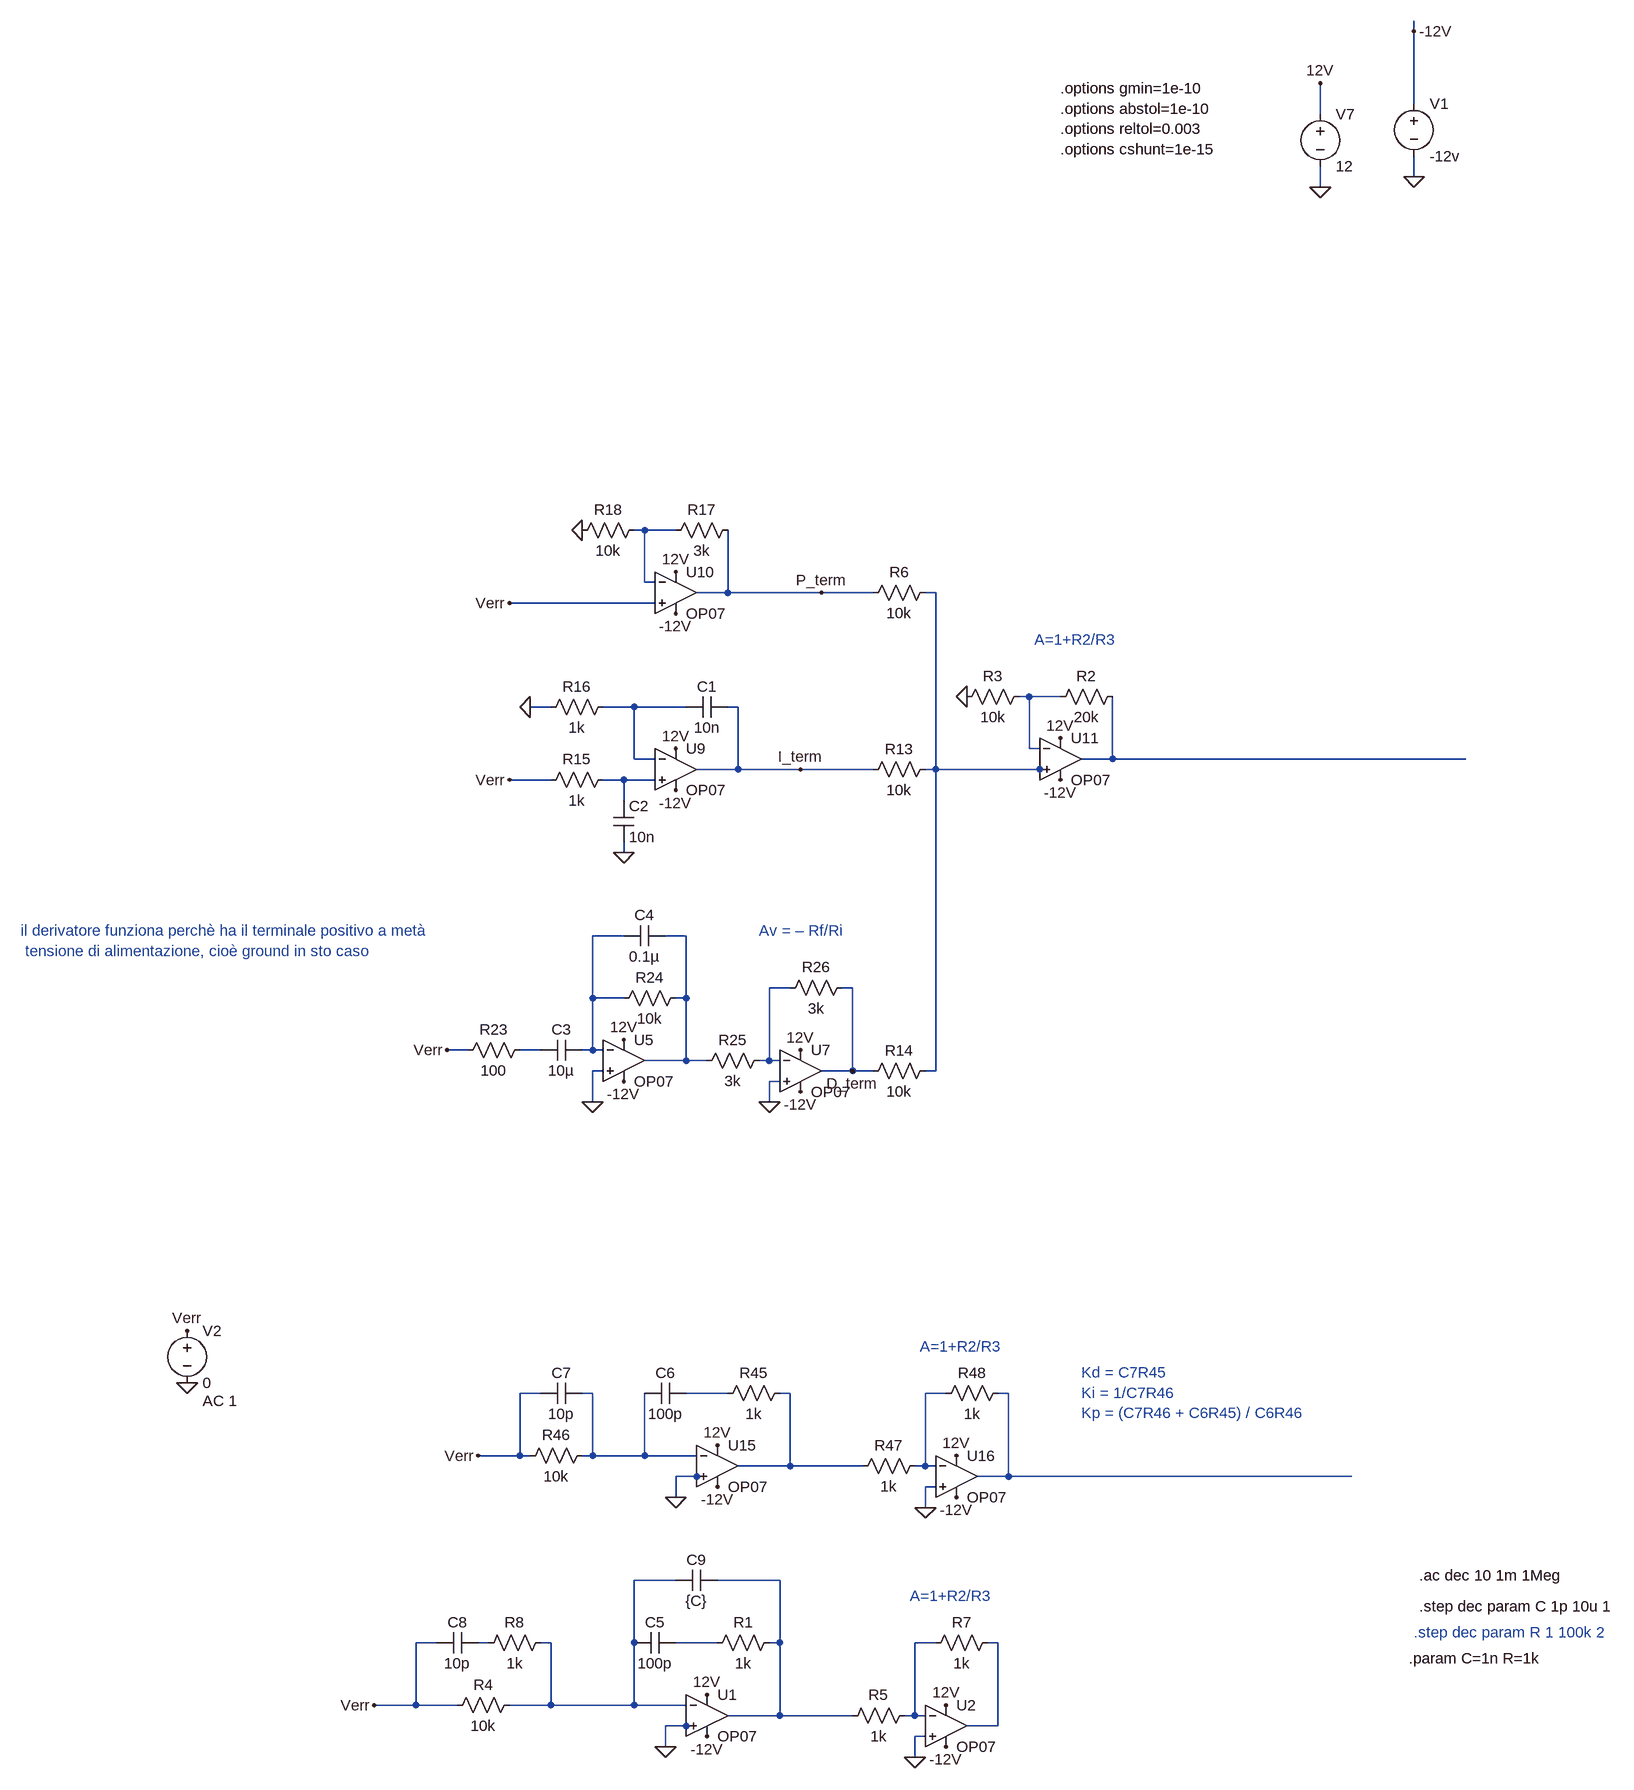
[diagram p0: schematic PID.asc]
PID.asc, the LTspice schematic file:
Version 4
SHEET 1 4364 2772
WIRE 1168 -1040 1168 -1056
WIRE 1168 -928 1168 -1040
WIRE 1024 -912 1024 -960
WIRE 1168 -816 1168 -848
WIRE 1024 -800 1024 -832
WIRE -16 -272 -32 -272
WIRE 32 -272 -16 -272
WIRE -16 -192 -16 -272
WIRE 0 -192 -16 -192
WIRE 112 -176 112 -272
WIRE 112 -176 64 -176
WIRE 256 -176 112 -176
WIRE 336 -176 256 -176
WIRE 432 -176 416 -176
WIRE 0 -160 -224 -160
WIRE 576 -16 560 -16
WIRE 624 -16 576 -16
WIRE -160 0 -192 0
WIRE -32 0 -80 0
WIRE 48 0 -32 0
WIRE 128 0 112 0
WIRE 576 64 576 -16
WIRE 592 64 576 64
WIRE -32 80 -32 0
WIRE 0 80 -32 80
WIRE 704 80 704 -16
WIRE 704 80 656 80
WIRE 1248 80 704 80
WIRE 128 96 128 0
WIRE 128 96 64 96
WIRE 224 96 128 96
WIRE 336 96 224 96
WIRE 432 96 432 -176
WIRE 432 96 416 96
WIRE 592 96 432 96
WIRE 608 96 592 96
WIRE -160 112 -224 112
WIRE -48 112 -80 112
WIRE 0 112 -48 112
WIRE -48 144 -48 112
WIRE -48 224 -48 208
WIRE -48 352 -96 352
WIRE 48 352 16 352
WIRE 208 432 176 432
WIRE 304 432 288 432
WIRE -96 448 -96 352
WIRE -48 448 -96 448
WIRE 48 448 48 352
WIRE 48 448 32 448
WIRE -288 528 -320 528
WIRE -176 528 -208 528
WIRE -96 528 -96 448
WIRE -96 528 -112 528
WIRE -80 528 -96 528
WIRE 48 544 48 448
WIRE 48 544 -16 544
WIRE 80 544 48 544
WIRE 176 544 176 432
WIRE 176 544 160 544
WIRE 192 544 176 544
WIRE -80 560 -96 560
WIRE 304 560 304 432
WIRE 304 560 256 560
WIRE 336 560 304 560
WIRE 432 560 432 96
WIRE 432 560 416 560
WIRE 192 576 176 576
WIRE -96 608 -96 560
WIRE 176 608 176 576
WIRE -176 1056 -208 1056
WIRE -96 1056 -112 1056
WIRE 112 1056 48 1056
WIRE 208 1056 192 1056
WIRE 448 1056 416 1056
WIRE 544 1056 528 1056
WIRE -208 1152 -208 1056
WIRE -208 1152 -272 1152
WIRE -192 1152 -208 1152
WIRE -96 1152 -96 1056
WIRE -96 1152 -112 1152
WIRE -16 1152 -16 1056
WIRE -16 1152 -96 1152
WIRE 64 1152 -16 1152
WIRE 208 1168 208 1056
WIRE 208 1168 128 1168
WIRE 320 1168 208 1168
WIRE 416 1168 416 1056
WIRE 416 1168 400 1168
WIRE 432 1168 416 1168
WIRE 64 1184 32 1184
WIRE 80 1184 64 1184
WIRE 544 1184 544 1056
WIRE 544 1184 496 1184
WIRE 1072 1184 544 1184
WIRE 432 1200 416 1200
WIRE 32 1216 32 1184
WIRE 416 1232 416 1200
WIRE 32 1344 -32 1344
WIRE 192 1344 96 1344
WIRE -336 1440 -368 1440
WIRE -256 1440 -272 1440
WIRE -160 1440 -176 1440
WIRE -32 1440 -32 1344
WIRE 96 1440 32 1440
WIRE 192 1440 192 1344
WIRE 192 1440 176 1440
WIRE 432 1440 400 1440
WIRE 528 1440 512 1440
WIRE -368 1536 -368 1440
WIRE -368 1536 -432 1536
WIRE -304 1536 -368 1536
WIRE -160 1536 -160 1440
WIRE -160 1536 -224 1536
WIRE -32 1536 -32 1440
WIRE -32 1536 -160 1536
WIRE 48 1536 -32 1536
WIRE 192 1552 192 1440
WIRE 192 1552 112 1552
WIRE 304 1552 192 1552
WIRE 400 1552 400 1440
WIRE 400 1552 384 1552
WIRE 416 1552 400 1552
WIRE 48 1568 16 1568
WIRE 64 1568 48 1568
WIRE 528 1568 528 1440
WIRE 528 1568 480 1568
WIRE 416 1584 400 1584
WIRE 16 1600 16 1568
WIRE 400 1616 400 1584
FLAG 1024 -800 0
FLAG 1024 -960 12V
FLAG 1168 -816 0
FLAG 1168 -1040 -12V
FLAG 32 128 -12V
FLAG 32 64 12V
FLAG 624 112 -12V
FLAG 624 48 12V
FLAG 480 -16 0
FLAG -192 0 0
FLAG -224 112 Verr
FLAG -48 224 0
FLAG 32 -144 -12V
FLAG 32 -208 12V
FLAG -112 -272 0
FLAG -224 -160 Verr
FLAG -48 576 -12V
FLAG -48 512 12V
FLAG -320 528 Verr
FLAG -96 608 0
FLAG 224 592 -12V
FLAG 224 528 12V
FLAG 176 608 0
FLAG 256 -176 P_term
FLAG 224 96 I_term
FLAG 304 560 D_term
FLAG 96 1200 -12V
FLAG 96 1136 12V
FLAG -272 1152 Verr
FLAG 32 1216 0
FLAG 464 1216 -12V
FLAG 464 1152 12V
FLAG 416 1232 0
FLAG 80 1584 -12V
FLAG 80 1520 12V
FLAG -432 1536 Verr
FLAG 16 1600 0
FLAG 448 1600 -12V
FLAG 448 1536 12V
FLAG 400 1616 0
FLAG -720 1040 0
FLAG -720 960 Verr
SYMBOL voltage 1024 -928 R0
WINDOW 123 0 0 Left 0
WINDOW 39 0 0 Left 0
SYMATTR InstName V7
SYMATTR Value 12
SYMBOL voltage 1168 -944 R0
WINDOW 123 0 0 Left 0
WINDOW 39 0 0 Left 0
SYMATTR InstName V1
SYMATTR Value -12v
SYMBOL res 720 -32 R90
WINDOW 0 0 56 VBottom 2
WINDOW 3 32 56 VTop 2
SYMATTR InstName R2
SYMATTR Value 20k
SYMBOL res 576 -32 R90
WINDOW 0 0 56 VBottom 2
WINDOW 3 32 56 VTop 2
SYMATTR InstName R3
SYMATTR Value 10k
SYMBOL res 432 -192 R90
WINDOW 0 0 56 VBottom 2
WINDOW 3 32 56 VTop 2
SYMATTR InstName R6
SYMATTR Value 10k
SYMBOL res 432 80 R90
WINDOW 0 0 56 VBottom 2
WINDOW 3 32 56 VTop 2
SYMATTR InstName R13
SYMATTR Value 10k
SYMBOL res 432 544 R90
WINDOW 0 0 56 VBottom 2
WINDOW 3 32 56 VTop 2
SYMATTR InstName R14
SYMATTR Value 10k
SYMBOL res -64 96 R90
WINDOW 0 0 56 VBottom 2
WINDOW 3 32 56 VTop 2
SYMATTR InstName R15
SYMATTR Value 1k
SYMBOL res -64 -16 R90
WINDOW 0 0 56 VBottom 2
WINDOW 3 32 56 VTop 2
SYMATTR InstName R16
SYMATTR Value 1k
SYMBOL cap 112 -16 R90
WINDOW 0 0 32 VBottom 2
WINDOW 3 32 32 VTop 2
SYMATTR InstName C1
SYMATTR Value 10n
SYMBOL cap -64 144 R0
SYMATTR InstName C2
SYMATTR Value 10n
SYMBOL res 128 -288 R90
WINDOW 0 0 56 VBottom 2
WINDOW 3 32 56 VTop 2
SYMATTR InstName R17
SYMATTR Value 3k
SYMBOL res -16 -288 R90
WINDOW 0 0 56 VBottom 2
WINDOW 3 32 56 VTop 2
SYMATTR InstName R18
SYMATTR Value 10k
SYMBOL cap -112 512 R90
WINDOW 0 0 32 VBottom 2
WINDOW 3 32 32 VTop 2
SYMATTR InstName C3
SYMATTR Value 10µ
SYMBOL res -192 512 R90
WINDOW 0 0 56 VBottom 2
WINDOW 3 32 56 VTop 2
SYMATTR InstName R23
SYMATTR Value 100
SYMBOL res 48 432 R90
WINDOW 0 0 56 VBottom 2
WINDOW 3 32 56 VTop 2
SYMATTR InstName R24
SYMATTR Value 10k
SYMBOL cap 16 336 R90
WINDOW 0 0 32 VBottom 2
WINDOW 3 32 32 VTop 2
SYMATTR InstName C4
SYMATTR Value 0.1µ
SYMBOL res 176 528 R90
WINDOW 0 0 56 VBottom 2
WINDOW 3 32 56 VTop 2
SYMATTR InstName R25
SYMATTR Value 3k
SYMBOL res 304 416 R90
WINDOW 0 0 56 VBottom 2
WINDOW 3 32 56 VTop 2
SYMATTR InstName R26
SYMATTR Value 3k
SYMBOL OpAmps\\OP07 -48 480 R0
SYMATTR InstName U5
SYMBOL OpAmps\\OP07 224 496 R0
SYMATTR InstName U7
SYMBOL OpAmps\\OP07 32 32 R0
SYMATTR InstName U9
SYMBOL OpAmps\\OP07 32 -240 R0
SYMATTR InstName U10
SYMBOL OpAmps\\OP07 624 16 R0
SYMATTR InstName U11
SYMBOL OpAmps\\OP07 96 1104 R0
SYMATTR InstName U15
SYMBOL res 208 1040 R90
WINDOW 0 0 56 VBottom 2
WINDOW 3 32 56 VTop 2
SYMATTR InstName R45
SYMATTR Value 1k
SYMBOL cap 48 1040 R90
WINDOW 0 0 32 VBottom 2
WINDOW 3 32 32 VTop 2
SYMATTR InstName C6
SYMATTR Value 100p
SYMBOL res -96 1136 R90
WINDOW 0 0 56 VBottom 2
WINDOW 3 32 56 VTop 2
SYMATTR InstName R46
SYMATTR Value 10k
SYMBOL res 416 1152 R90
WINDOW 0 0 56 VBottom 2
WINDOW 3 32 56 VTop 2
SYMATTR InstName R47
SYMATTR Value 1k
SYMBOL res 544 1040 R90
WINDOW 0 0 56 VBottom 2
WINDOW 3 32 56 VTop 2
SYMATTR InstName R48
SYMATTR Value 1k
SYMBOL OpAmps\\OP07 464 1120 R0
SYMATTR InstName U16
SYMBOL cap -112 1040 R90
WINDOW 0 0 32 VBottom 2
WINDOW 3 32 32 VTop 2
SYMATTR InstName C7
SYMATTR Value 10p
SYMBOL OpAmps\\OP07 80 1488 R0
SYMATTR InstName U1
SYMBOL res 192 1424 R90
WINDOW 0 0 56 VBottom 2
WINDOW 3 32 56 VTop 2
SYMATTR InstName R1
SYMATTR Value 1k
SYMBOL cap 32 1424 R90
WINDOW 0 0 32 VBottom 2
WINDOW 3 32 32 VTop 2
SYMATTR InstName C5
SYMATTR Value 100p
SYMBOL res -208 1520 R90
WINDOW 0 0 56 VBottom 2
WINDOW 3 32 56 VTop 2
SYMATTR InstName R4
SYMATTR Value 10k
SYMBOL res 400 1536 R90
WINDOW 0 0 56 VBottom 2
WINDOW 3 32 56 VTop 2
SYMATTR InstName R5
SYMATTR Value 1k
SYMBOL res 528 1424 R90
WINDOW 0 0 56 VBottom 2
WINDOW 3 32 56 VTop 2
SYMATTR InstName R7
SYMATTR Value 1k
SYMBOL OpAmps\\OP07 448 1504 R0
SYMATTR InstName U2
SYMBOL cap -272 1424 R90
WINDOW 0 0 32 VBottom 2
WINDOW 3 32 32 VTop 2
SYMATTR InstName C8
SYMATTR Value 10p
SYMBOL cap 96 1328 R90
WINDOW 0 0 32 VBottom 2
WINDOW 3 32 32 VTop 2
SYMATTR InstName C9
SYMATTR Value {C}
SYMBOL voltage -720 944 R0
WINDOW 123 24 124 Left 2
WINDOW 39 0 0 Left 0
SYMATTR Value2 AC 1
SYMATTR InstName V2
SYMATTR Value 0
SYMBOL res -160 1424 R90
WINDOW 0 0 56 VBottom 2
WINDOW 3 32 56 VTop 2
SYMATTR InstName R8
SYMATTR Value 1k
TEXT 624 -952 Left 2 !.options gmin=1e-10\n.options abstol=1e-10\n.options reltol=0.003\n.options cshunt=1e-15
TEXT 1168 1424 Left 2 ;.step dec param R 1 100k 2
TEXT 584 -104 Left 2 ;A=1+R2/R3
TEXT 1176 1384 Left 2 !.step dec param C 1p 10u 1
TEXT -976 344 Left 2 ;il derivatore funziona perchè ha il terminale positivo a metà\n tensione di alimentazione, cioè ground in sto caso
TEXT 160 344 Left 2 ;Av = – Rf/Ri
TEXT 408 984 Left 2 ;A=1+R2/R3
TEXT 656 1024 Left 2 ;Kd = C7R45\nKi = 1/C7R46\nKp = (C7R46 + C6R45) / C6R46
TEXT 1160 1464 Left 2 !.param C=1n R=1k
TEXT 392 1368 Left 2 ;A=1+R2/R3
TEXT 1176 1336 Left 2 !.ac dec 10 1m 1Meg

The netlist it stands for:
* PID.asc
V7 12V 0 12
V1 -12V 0 -12v
R2 N005 N003 20k
R3 N003 0 10k
R6 N002 P_term 10k
R13 N002 I_term 10k
R14 N002 D_term 10k
R15 N006 Verr 1k
R16 N004 0 1k
C1 I_term N004 10n
C2 N006 0 10n
R17 P_term N001 3k
R18 N001 0 10k
C3 N007 N010 10µ
R23 N010 Verr 100
R24 N008 N007 10k
C4 N008 N007 0.1µ
R25 N009 N008 3k
R26 D_term N009 3k
XU5 0 N007 12V -12V N008 LT1001  ; OP07, pins In+ In- V+ V- OUT
XU7 0 N009 12V -12V D_term LT1001  ; OP07, pins In+ In- V+ V- OUT
XU9 N006 N004 12V -12V I_term LT1001  ; OP07, pins In+ In- V+ V- OUT
XU10 Verr N001 12V -12V P_term LT1001  ; OP07, pins In+ In- V+ V- OUT
XU11 N002 N003 12V -12V N005 LT1001  ; OP07, pins In+ In- V+ V- OUT
XU15 0 N011 12V -12V N013 LT1001  ; OP07, pins In+ In- V+ V- OUT
R45 N013 N012 1k
C6 N012 N011 100p
R46 N011 Verr 10k
R47 N014 N013 1k
R48 N015 N014 1k
XU16 0 N014 12V -12V N015 LT1001  ; OP07, pins In+ In- V+ V- OUT
C7 N011 Verr 10p
XU1 0 N016 12V -12V N017 LT1001  ; OP07, pins In+ In- V+ V- OUT
R1 N017 N019 1k
C5 N019 N016 100p
R4 N016 Verr 10k
R5 N020 N017 1k
R7 N021 N020 1k
XU2 0 N020 12V -12V N021 LT1001  ; OP07, pins In+ In- V+ V- OUT
C8 N018 Verr 10p
C9 N017 N016 {C}
V2 Verr 0 0 AC 1
R8 N016 N018 1k
.options gmin=1e-10
.options abstol=1e-10
.options reltol=0.003
.options cshunt=1e-15
* .step dec param R 1 100k 2
* A=1+R2/R3
.step dec param C 1p 10u 1
* il derivatore funziona perchè ha il terminale positivo a metà
*  tensione di alimentazione, cioè ground in sto caso
* Av = – Rf/Ri
* A=1+R2/R3
* Kd = C7R45
* Ki = 1/C7R46
* Kp = (C7R46 + C6R45) / C6R46
.param C=1n R=1k
* A=1+R2/R3
.ac dec 10 1m 1Meg
.lib LTC.lib
.backanno
.end

* Results of the author's LTspice run, read from the files saved beside the schematic
* Operating Point (first step), zero values left out:
*   c = 1 p
*   V(12v) = 12 V
*   V(-12v) = -12 V
*   I(V1) = 20.25 mA
*   I(V7) = -20.25 mA
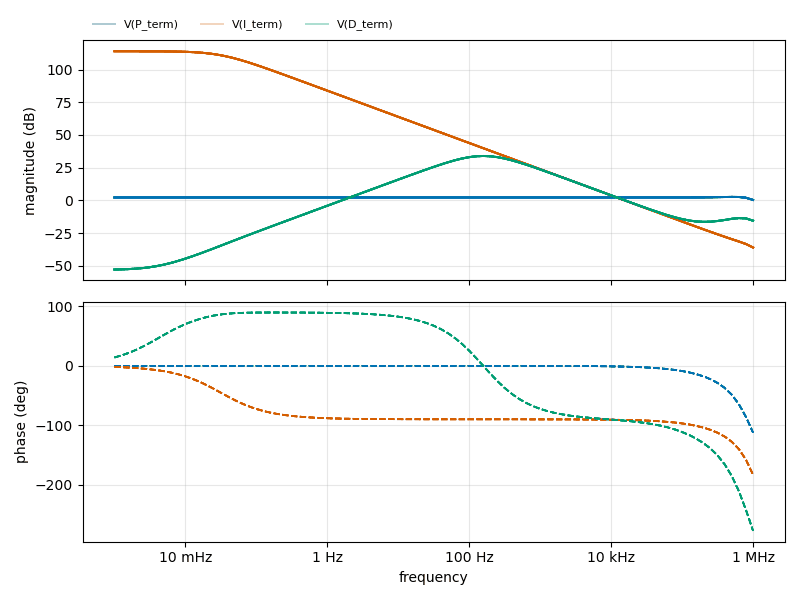
[diagram p1: AC Analysis of PID.asc, plotted from the saved traces]
* AC Analysis, 8 runs:
*   V(P_term) [c=1e-012]: 2.29 dB at 1 mHz, 0.38 dB at 1 MHz, peak 2.71 dB at 501.2 kHz
*   V(P_term) [c=1e-011]: 2.29 dB at 1 mHz, 0.38 dB at 1 MHz, peak 2.71 dB at 501.2 kHz
*   V(P_term) [c=1e-010]: 2.29 dB at 1 mHz, 0.38 dB at 1 MHz, peak 2.71 dB at 501.2 kHz
*   V(P_term) [c=1e-009]: 2.29 dB at 1 mHz, 0.38 dB at 1 MHz, peak 2.71 dB at 501.2 kHz
*   V(P_term) [c=1e-008]: 2.29 dB at 1 mHz, 0.38 dB at 1 MHz, peak 2.71 dB at 501.2 kHz
*   V(P_term) [c=1e-007]: 2.29 dB at 1 mHz, 0.38 dB at 1 MHz, peak 2.71 dB at 501.2 kHz
*   V(P_term) [c=1e-006]: 2.29 dB at 1 mHz, 0.38 dB at 1 MHz, peak 2.71 dB at 501.2 kHz
*   V(P_term) [c=1e-005]: 2.29 dB at 1 mHz, 0.38 dB at 1 MHz, peak 2.71 dB at 501.2 kHz
*   V(I_term) [c=1e-012]: 113.96 dB at 1 mHz, -35.95 dB at 1 MHz, peak 113.96 dB at 1 mHz, 3 dB below the peak at 31.31 mHz
*   V(I_term) [c=1e-011]: 113.96 dB at 1 mHz, -35.95 dB at 1 MHz, peak 113.96 dB at 1 mHz, 3 dB below the peak at 31.31 mHz
*   V(I_term) [c=1e-010]: 113.96 dB at 1 mHz, -35.95 dB at 1 MHz, peak 113.96 dB at 1 mHz, 3 dB below the peak at 31.31 mHz
*   V(I_term) [c=1e-009]: 113.96 dB at 1 mHz, -35.95 dB at 1 MHz, peak 113.96 dB at 1 mHz, 3 dB below the peak at 31.31 mHz
*   V(I_term) [c=1e-008]: 113.96 dB at 1 mHz, -35.95 dB at 1 MHz, peak 113.96 dB at 1 mHz, 3 dB below the peak at 31.31 mHz
*   V(I_term) [c=1e-007]: 113.96 dB at 1 mHz, -35.95 dB at 1 MHz, peak 113.96 dB at 1 mHz, 3 dB below the peak at 31.31 mHz
*   V(I_term) [c=1e-006]: 113.96 dB at 1 mHz, -35.95 dB at 1 MHz, peak 113.96 dB at 1 mHz, 3 dB below the peak at 31.31 mHz
*   V(I_term) [c=1e-005]: 113.96 dB at 1 mHz, -35.95 dB at 1 MHz, peak 113.96 dB at 1 mHz, 3 dB below the peak at 31.31 mHz
*   V(D_term) [c=1e-012]: -52.79 dB at 1 mHz, -15.45 dB at 1 MHz, peak 33.98 dB at 158.5 Hz, 3 dB below the peak at 65.94 Hz and 376.8 Hz
*   V(D_term) [c=1e-011]: -52.79 dB at 1 mHz, -15.45 dB at 1 MHz, peak 33.98 dB at 158.5 Hz, 3 dB below the peak at 65.94 Hz and 376.8 Hz
*   V(D_term) [c=1e-010]: -52.79 dB at 1 mHz, -15.45 dB at 1 MHz, peak 33.98 dB at 158.5 Hz, 3 dB below the peak at 65.94 Hz and 376.8 Hz
*   V(D_term) [c=1e-009]: -52.79 dB at 1 mHz, -15.45 dB at 1 MHz, peak 33.98 dB at 158.5 Hz, 3 dB below the peak at 65.94 Hz and 376.8 Hz
*   V(D_term) [c=1e-008]: -52.79 dB at 1 mHz, -15.45 dB at 1 MHz, peak 33.98 dB at 158.5 Hz, 3 dB below the peak at 65.94 Hz and 376.8 Hz
*   V(D_term) [c=1e-007]: -52.79 dB at 1 mHz, -15.45 dB at 1 MHz, peak 33.98 dB at 158.5 Hz, 3 dB below the peak at 65.94 Hz and 376.8 Hz
*   V(D_term) [c=1e-006]: -52.79 dB at 1 mHz, -15.45 dB at 1 MHz, peak 33.98 dB at 158.5 Hz, 3 dB below the peak at 65.94 Hz and 376.8 Hz
*   V(D_term) [c=1e-005]: -52.79 dB at 1 mHz, -15.45 dB at 1 MHz, peak 33.98 dB at 158.5 Hz, 3 dB below the peak at 65.94 Hz and 376.8 Hz